# EAGLE design OLED_Kij_SPI (EAGLE 7.4.0)
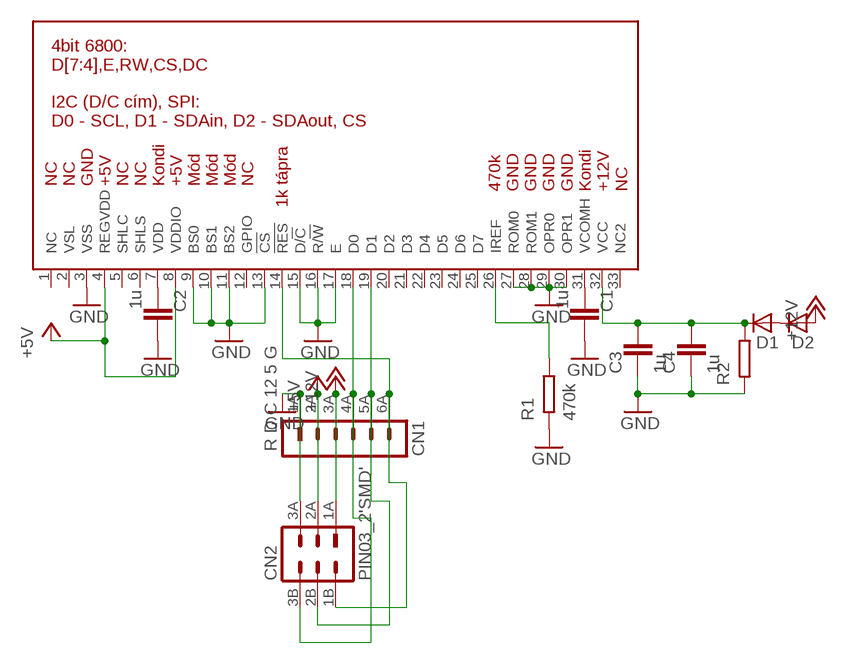
[diagram p0: schematic, sheet 1]

## Parts
C1  1u  C0805  [R0805]
C2  1u  C0805  [R0805]
C3  1u  C0805  [R0805]
C4  1u  C0805  [R0805]
CN1  R D C 12 5 G  PIN06_1SMD  [PIN_HEADER_1X6]
CN2  PIN03_2'SMD'  [PIN_HEADER_2X3]
D1  D0805  [D0805]
D2  D0805  [D0805]
R1  470k  R_EU0805  [R0805]
R2  R_EU0805  [R0805]
U$1  OLED_DISPL  [OLED_DISPL]

## Nets
+5V: CN1.2A CN2.2A U$1.4(REGVDD) U$1.8(VDDIO)
+12V: CN1.3A CN2.1A D2.1(A)
GND: C1.1 C2.1 C3.2 C4.2 CN1.1A CN2.3A R1.1(A) R2.1(A) U$1.3(VSS) U$1.9(BS0) U$1.10(BS1) U$1.11(BS2) U$1.13(!CS) U$1.15(D/!C) U$1.16(R/!W) U$1.17(E) U$1.27(ROM0) U$1.28(ROM1) U$1.29(OPR0) U$1.30(OPR1)
N$1: C1.2 U$1.31(VCOMH)
N$2: C2.2 U$1.7(VDD)
N$5: D1.1(A) D2.2(C)
N$6: C3.1 C4.1 D1.2(C) R2.2(E) U$1.32(VCC)
N$10: R1.2(E) U$1.26(IREF)
N$15: CN1.4A CN2.3B U$1.18(D0)
N$16: CN1.5A CN2.2B U$1.19(D1)
N$20: CN1.6A CN2.1B U$1.14(!RES)
Unconnected: U$1.1(NC) U$1.2(VSL) U$1.5(SHLC) U$1.6(SHLS) U$1.12(GPIO) U$1.20(D2) U$1.21(D3) U$1.22(D4) U$1.23(D5) U$1.24(D6) U$1.25(D7) U$1.33(NC2)

## Library data of the parts
C1-C4 = Cf_RLCPX:C
CN1 = Cf_Csatl:PIN06_1
CN2 = Cf_Csatl:PIN03_2
D1 D2 = Cf_Felv:D
R1 R2 = Cf_RLCPX:R_EU
U$1 = narval:OLED_DISPL

## Net classes
0 default: width 0.305 mm, clearance 0.305 mm

## Board
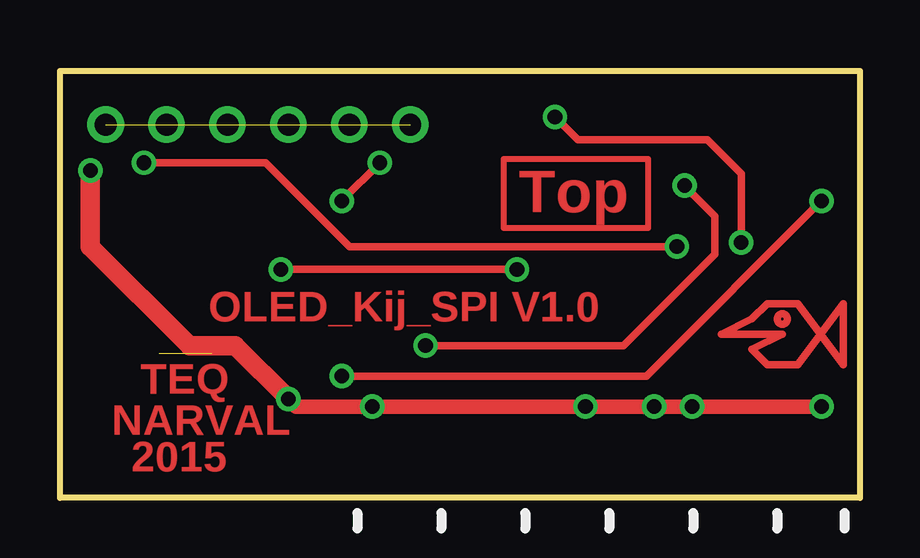
[diagram p1: board, top side]
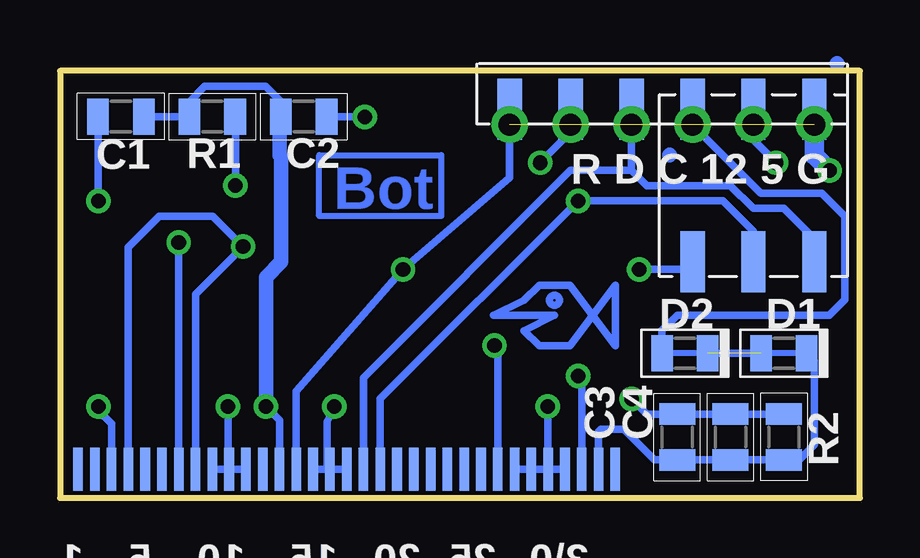
[diagram p2: board, bottom side, seen from below]

Size 33.35 x 17.8 mm. Coordinates in mm from the lower left corner, seen from the top.
Outline: 33.35,17.8 33.35,0 0,0 0,17.8 33.35,17.8
Copper layers (1*16): Top 0.035mm / dielectric 1.5mm / Bottom 0.035mm
Design rules "default": minimum track width 10mil, minimum drill 24mil, track to track 10mil, track to pad 10mil, pad to pad 10mil, via to via 10mil, smd to smd 8mil, copper to edge 40mil, drill to drill 8mil, minimum pad ring 10mil, minimum via ring 8mil, stop-mask expansion 4mil, vias tented up to drill 0mil, thermal gap 10mil

### Footprints (pad centres in the part's own frame; a part is rotated, then mirrored left to right if it is on the bottom)
R0805 = smd 0.9 x 1.5: 1 -0.953,0; 2 0.953,0
PIN_HEADER_1X6 = smd 1.016 x 2.54: 1A -6.35,0.635; 2A -3.81,0.635; 3A -1.27,0.635; 4A 1.27,0.635; 5A 3.81,0.635; 6A 6.35,0.635
PIN_HEADER_2X3 = smd 1.016 x 2.54: 1A -2.54,3.175; 1B -2.54,-3.175; 2A 0,3.175; 2B 0,-3.175; 3A 2.54,3.175; 3B 2.54,-3.175
D0805 = smd 0.9 x 1.5: 1 -0.953,0; 2 0.953,0
OLED_DISPL = smd 0.4 x 1.8: 1 -11.2,0; 2 -10.5,0; 3 -9.8,0; 4 -9.1,0; 5 -8.4,0; 6 -7.7,0; 7 -7,0; 8 -6.3,0; 9 -5.6,0; 10 -4.9,0; 11 -4.2,0; 12 -3.5,0; 13 -2.8,0; 14 -2.1,0; 15 -1.4,0; 16 -0.7,0; 17 0,0; 18 0.7,0; 19 1.4,0; 20 2.1,0; 21 2.8,0; 22 3.5,0; 23 4.2,0; 24 4.9,0; 25 5.6,0; 26 6.3,0; 27 7,0; 28 7.7,0; 29 8.4,0; 30 9.1,0; 31 9.8,0; 32 10.5,0; 33 11.2,0

### Placement (x,y rotation side)
C1  30.81,15.89 180 bottom
C2  23.19,15.89 0 bottom
C3  7.62,2.54 90 bottom
C4  5.4,2.54 90 bottom
CN1  8.26,16.83 180 bottom
CN2  4.45,13.02 0 bottom
D1  3.17,6.03 0 bottom
D2  7.3,6.03 0 bottom
R1  27,15.89 0 bottom
R2  3.17,2.54 270 bottom
U$1  21.4,1.2 0 bottom

### Tracks (layer width: path | path; a pad name or v marks a point on that pad's centre or on a via)
+5V  (via drill 0.61)
  Top 0.305: v25.72,10.48 12.06,10.48 8.57,13.97 v3.49,13.97
  Bottom 0.305: U$1.8 27.7,8.49 v25.72,10.48 26.99,11.75 29.21,11.75 30.5,10.46 U$1.4 | v3.49,13.97 4.45,14.92 CN2.2A
+12V
  Bottom 0.305: D2.1 8.26,6.99 7.62,7.62 1.27,7.62 0.63,8.26 0.63,11.75 1.59,12.7 4.13,12.7 6.99,15.56 CN2.1A
GND  (via drill 0.61)
  Top 0.61: v31.75,3.81 v26.35,3.81 v24.77,3.81 v21.91,3.81 v13.02,3.81 9.84,3.81 v9.52,4.13
  Top 0.813: v9.52,4.13 7.3,6.35 5.4,6.35 1.27,10.48 v1.27,13.65
  Bottom 0.254: U$1.27 U$1.28 U$1.29
  Bottom 0.305: C1.1 R1.1 27.94,15.89 27.94,16.51 27.32,17.15 24.78,17.15 24.13,16.51 24.13,15.89 C2.1 24.2,15.84 | U$1.29 U$1.30 | U$1.17 U$1.16 U$1.15 22.3,1.2 22.23,1.27 22.23,3.17 v21.91,3.81 | U$1.9 U$1.10 U$1.11 26.28,1.2 26.35,1.27 v26.35,3.81 | U$1.27 13.09,1.2 13.02,1.27 v13.02,3.81 | U$1.3 31.2,3.09 31.75,3.63 v31.75,3.81 | U$1.13 24.2,3.25 v24.77,3.81 | R2.1 C4.2 C3.2 8.89,3.49 v9.52,4.13
  Bottom 0.61: 24.2,15.84 24.2,14.29 24.13,14.21 24.13,9.84 24.77,9.21 v24.77,3.81
  Bottom 0.813: v1.27,13.65 1.91,14.29 CN2.3A
HALACSKA6
  Bottom 0.305: 10.2,8.88 10.2,6.33 12.1,8.88 13.37,8.88 14.01,8.24 15.28,7.61 12.74,7.61 14.01,6.97 13.37,6.33 12.1,6.33 10.2,8.88
N$1  (via drill 0.61)
  Top 0.305: v11.75,5.08 24.45,5.08 v31.75,12.38
  Bottom 0.305: U$1.31 11.6,4.62 v11.75,5.08 | v31.75,12.38 31.75,15.88 C1.2
N$2  (via drill 0.61)
  Top 0.305: v28.4,10.65 28.4,13.51 26.99,14.92 21.59,14.92 v20.64,15.88
  Bottom 0.305: v20.64,15.88 22.22,15.88 C2.2 | U$1.7 v28.4,10.65
N$3  (1 unrouted)
  Bottom 0.254: 6.35,6.03 8.26,6.03 | 2.22,6.03 4.13,6.03
N$4
  Bottom 0.254: 17.46,11.75 22.54,11.75 22.54,14.29 17.46,14.29 17.46,11.75
N$5
  Bottom 0.305: D2.2 D1.1
N$6
  Bottom 0.305: U$1.32 10.9,2.75 10.8,2.86 9.84,2.86 8.57,1.59 C3.1 C4.1 R2.2 2.54,1.59 1.91,2.22 1.91,5.71 D1.2
N$7  (via drill 0.91 pad 1.52)  (5 unrouted)
  other vias: 1.91,15.56 4.45,15.56 6.98,15.56 9.52,15.56 12.06,15.56 14.6,15.56
N$10  (via drill 0.61)
  Top 0.305: v15.24,6.35 23.49,6.35 27.31,10.16 27.31,11.75 v26.03,13.02
  Bottom 0.305: U$1.26 15.1,6.21 v15.24,6.35 | v26.03,13.02 26.03,15.88 R1.2
N$15
  Bottom 0.305: U$1.18 20.7,5.01 12.06,13.65 9.52,13.65 | 9.52,13.65 8.89,13.02 5.4,13.02 4.45,12.06 3.17,12.06 1.91,10.79 CN2.3B | 9.52,13.65 CN1.4A
N$16  (via drill 0.61)
  Top 0.305: v11.75,12.38 v13.34,13.97
  Bottom 0.305: U$1.19 20,4.13 v11.75,12.38 5.71,12.38 4.45,11.11 CN2.2B | v13.34,13.97 12.06,15.24 CN1.5A
N$20  (via drill 0.61)
  Top 0.305: v19.05,9.53 v9.21,9.53
  Bottom 0.305: U$1.14 23.5,4.44 v19.05,9.53 14.6,13.34 CN1.6A | CN2.1B 7.3,9.53 v9.21,9.53
N$64
  Top 0.305: 32.66,8.09 32.66,5.55 30.75,8.09 29.48,8.09 28.85,7.46 27.58,6.82 30.12,6.82 28.85,6.19 29.48,5.55 30.75,5.55 32.66,8.09
N$68
  Top 0.254: 24.53,11.26 24.53,14.12 18.49,14.12 18.49,11.26 24.53,11.26
(copper drawn outside any net)
  shapes: Bottom circle x1, Top circle x1

### Text on the board
Top: Top | OLED_Kij_SPI V1.0 | TEQ | NARVAL | 2015
Bottom: Bot
bNames: 3\0 | 25 | 20 | 15 | 10 | 5 | 1